# EAGLE schematic zero_board (EAGLE 9.5.2)
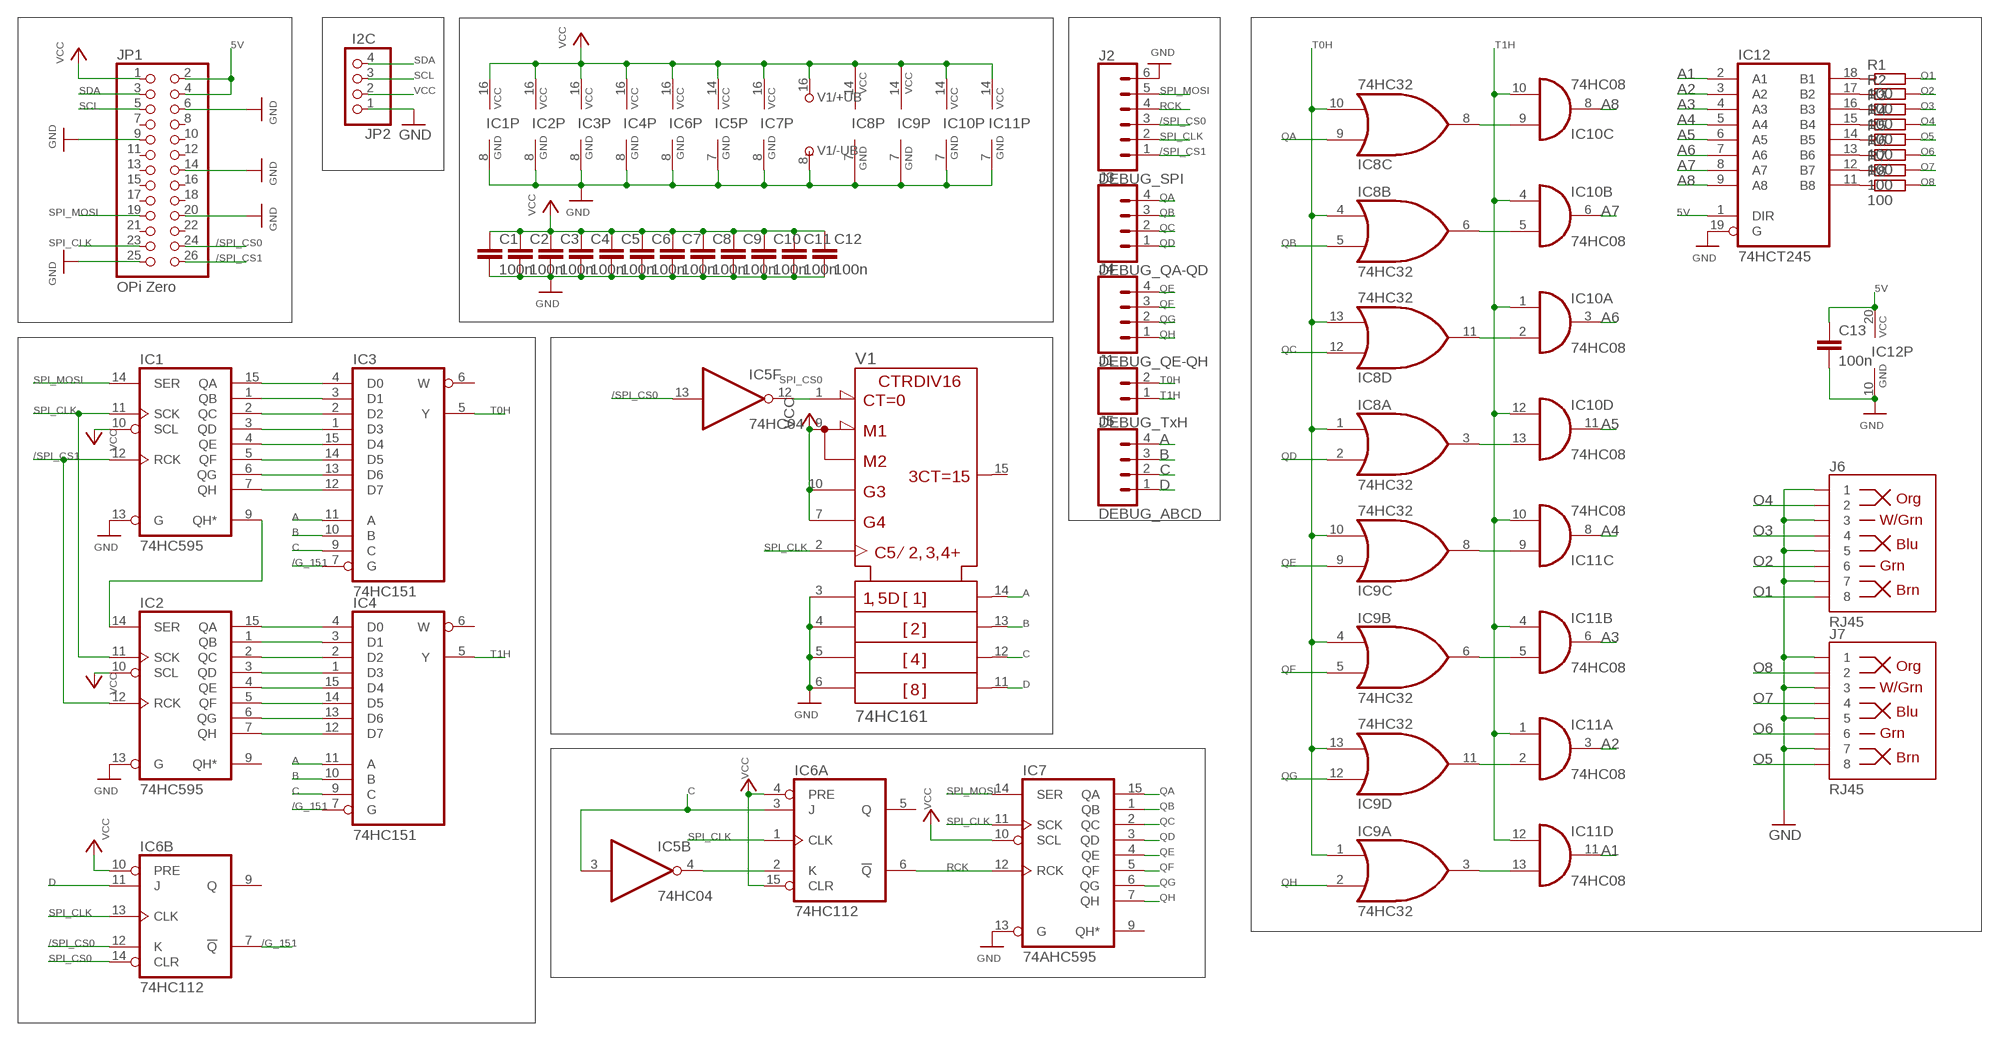
[diagram p0: schematic, sheet 1]

## Parts
C1  100n  C-EU050-024X044  [C050-024X044]
C2  100n  C-EU050-024X044  [C050-024X044]
C3  100n  C-EU050-024X044  [C050-024X044]
C4  100n  C-EU050-024X044  [C050-024X044]
C5  100n  C-EU050-024X044  [C050-024X044]
C6  100n  C-EU050-024X044  [C050-024X044]
C7  100n  C-EU050-024X044  [C050-024X044]
C8  100n  C-EU050-024X044  [C050-024X044]
C9  100n  C-EU050-024X044  [C050-024X044]
C10  100n  C-EU050-024X044  [C050-024X044]
C11  100n  C-EU050-024X044  [C050-024X044]
C12  100n  C-EU050-024X044  [C050-024X044]
C13  100n  C-EU050-024X044  [C050-024X044]
IC1  74HC595  74HC595N  [DIL16]
IC2  74HC595  74HC595N  [DIL16]
IC3  74HC151  74HC151N  [DIL16]
IC4  74HC151  74HC151N  [DIL16]
IC5  74HC04  74HC04N  [DIL14]
IC6  74HC112  74HC112N  [DIL16]
IC7  74AHC595  74HC595D  [SO16]
IC8  74HC32  74LS32N  [DIL14]
IC9  74HC32  74LS32N  [DIL14]
IC10  74HC08  74AS08N  [DIL14]
IC11  74HC08  74AS08N  [DIL14]
IC12  74HCT245  74ACT245N  [DIL20]
J1  DEBUG_TxH  CONN_02  [1X02]
J2  DEBUG_SPI  CONN_06LOCK  [1X06_LOCK]
J3  DEBUG_QA-QD  CONN_04LOCK  [1X04_LOCK]
J4  DEBUG_QE-QH  CONN_04LOCK  [1X04_LOCK]
J5  DEBUG_ABCD  CONN_04LOCK  [1X04_LOCK]
J6  RJ45  RJ45-8  [RJ45-8]
J7  RJ45  RJ45-8  [RJ45-8]
JP1  OPi Zero  PINHD-2X13  [2X13]
JP2  I2C  PINHD-1X4  [1X04]
R1  100  R-EU_0204/5  [0204/5]
R2  100  R-EU_0204/5  [0204/5]
R3  100  R-EU_0204/5  [0204/5]
R4  100  R-EU_0204/5  [0204/5]
R5  100  R-EU_0204/5  [0204/5]
R6  100  R-EU_0204/5  [0204/5]
R7  100  R-EU_0204/5  [0204/5]
R8  100  R-EU_0204/5  [0204/5]
V1  74HC161  74161N  [DIL16]

## Nets
5V: C13.1 IC12.1(DIR) IC12.20(VCC) JP1.2 JP1.4
/G_151: IC3.7(G) IC4.7(G) IC6.7(B:!Q)
/SPI_CS0: IC5.13(F:I) IC6.12(B:K) J2.3 JP1.24
/SPI_CS1: IC1.12(RCK) IC2.12(RCK) J2.1 JP1.26
A: IC3.11(A) IC4.11(A) J5.4 V1.14(QA)
A1: IC11.11(D:O) IC12.2(A1)
A2: IC11.3(A:O) IC12.3(A2)
A3: IC11.6(B:O) IC12.4(A3)
A4: IC11.8(C:O) IC12.5(A4)
A5: IC10.11(D:O) IC12.6(A5)
A6: IC10.3(A:O) IC12.7(A6)
A7: IC10.6(B:O) IC12.8(A7)
A8: IC10.8(C:O) IC12.9(A8)
B: IC3.10(B) IC4.10(B) J5.3 V1.13(QB)
C: IC3.9(C) IC4.9(C) IC5.3(B:I) IC6.3(A:J) J5.2 V1.12(QC)
D: IC6.11(B:J) J5.1 V1.11(QD)
GND: C1.2 C2.2 C3.2 C4.2 C5.2 C6.2 C7.2 C8.2 C9.2 C10.2 C11.2 C12.2 C13.2 IC1.8(GND) IC1.13(G) IC2.8(GND) IC2.13(G) IC3.8(GND) IC4.8(GND) IC5.7(P:GND) IC6.8(P:GND) IC7.8(GND) IC7.13(G) IC8.7(P:GND) IC9.7(P:GND) IC10.7(P:GND) IC11.7(P:GND) IC12.10(GND) IC12.19(G) J2.6 J6.1 J6.3 J6.5 J6.7 J7.1 J7.3 J7.5 J7.7 JP1.6 JP1.9 JP1.14 JP1.20 JP1.25 JP2.1 V1.3(A) V1.4(B) V1.5(C) V1.6(D) V1.8(-UB)
N$1: IC9.8(C:O) IC11.9(C:I0)
N$2: IC9.6(B:O) IC11.5(B:I1)
N$3: IC9.11(D:O) IC11.2(A:I1)
N$4: IC9.3(A:O) IC11.13(D:I1)
N$5: IC8.8(C:O) IC10.9(C:I0)
N$6: IC8.6(B:O) IC10.5(B:I1)
N$7: IC8.11(D:O) IC10.2(A:I1)
N$11: IC1.15(QA) IC3.4(D0)
N$12: IC1.1(QB) IC3.3(D1)
N$13: IC1.2(QC) IC3.2(D2)
N$14: IC1.3(QD) IC3.1(D3)
N$15: IC5.4(B:O) IC6.2(A:K)
N$16: IC8.3(A:O) IC10.13(D:I1)
N$19: IC2.15(QA) IC4.4(D0)
N$21: IC1.4(QE) IC3.15(D4)
N$22: IC1.5(QF) IC3.14(D5)
N$23: IC1.6(QG) IC3.13(D6)
N$24: IC1.7(QH) IC3.12(D7)
N$25: IC2.1(QB) IC4.3(D1)
N$27: IC2.2(QC) IC4.2(D2)
N$28: IC2.3(QD) IC4.1(D3)
N$29: IC2.4(QE) IC4.15(D4)
N$30: IC2.5(QF) IC4.14(D5)
N$31: IC2.6(QG) IC4.13(D6)
N$32: IC2.7(QH) IC4.12(D7)
N$35: IC12.18(B1) R1.1
N$37: IC12.17(B2) R2.1
N$38: IC12.16(B3) R3.1
N$39: IC12.15(B4) R4.1
N$40: IC12.14(B5) R5.1
N$41: IC12.13(B6) R6.1
N$42: IC12.12(B7) R7.1
N$43: IC12.11(B8) R8.1
N$44: IC1.9(QH*) IC2.14(SER)
O1: J6.8 R1.2
O2: J6.6 R2.2
O3: J6.4 R3.2
O4: J6.2 R4.2
O5: J7.8 R5.2
O6: J7.6 R6.2
O7: J7.4 R7.2
O8: J7.2 R8.2
QA: IC7.15(QA) IC8.9(C:I0) J3.4
QB: IC7.1(QB) IC8.5(B:I1) J3.3
QC: IC7.2(QC) IC8.12(D:I0) J3.2
QD: IC7.3(QD) IC8.2(A:I1) J3.1
QE: IC7.4(QE) IC9.9(C:I0) J4.4
QF: IC7.5(QF) IC9.5(B:I1) J4.3
QG: IC7.6(QG) IC9.12(D:I0) J4.2
QH: IC7.7(QH) IC9.2(A:I1) J4.1
RCK: IC6.6(A:!Q) IC7.12(RCK) J2.4
SCL: JP1.5 JP2.3
SDA: JP1.3 JP2.4
SPI_CLK: IC1.11(SCK) IC2.11(SCK) IC6.1(A:CLK) IC6.13(B:CLK) IC7.11(SCK) J2.2 JP1.23 V1.2(CLK)
SPI_CS0: IC5.12(F:O) IC6.14(B:CLR) V1.1(!CLR)
SPI_MOSI: IC1.14(SER) IC7.14(SER) J2.5 JP1.19
T0H: IC3.5(Y) IC8.1(A:I0) IC8.4(B:I0) IC8.10(C:I1) IC8.13(D:I1) IC9.1(A:I0) IC9.4(B:I0) IC9.10(C:I1) IC9.13(D:I1) J1.2
T1H: IC4.5(Y) IC10.1(A:I0) IC10.4(B:I0) IC10.10(C:I1) IC10.12(D:I0) IC11.1(A:I0) IC11.4(B:I0) IC11.10(C:I1) IC11.12(D:I0) J1.1
VCC: C1.1 C2.1 C3.1 C4.1 C5.1 C6.1 C7.1 C8.1 C9.1 C10.1 C11.1 C12.1 IC1.10(SCL) IC1.16(VCC) IC2.10(SCL) IC2.16(VCC) IC3.16(VCC) IC4.16(VCC) IC5.14(P:VCC) IC6.4(A:PRE) IC6.10(B:PRE) IC6.15(A:CLR) IC6.16(P:VCC) IC7.10(SCL) IC7.16(VCC) IC8.14(P:VCC) IC9.14(P:VCC) IC10.14(P:VCC) IC11.14(P:VCC) JP1.1 JP2.2 V1.7(ENP) V1.9(!LOAD) V1.10(ENT) V1.16(+UB)
Unconnected: IC2.9(QH*) IC3.6(W) IC4.6(W) IC5.1(A:I) IC5.2(A:O) IC5.5(C:I) IC5.6(C:O) IC5.8(D:O) IC5.9(D:I) IC5.10(E:O) IC5.11(E:I) IC6.5(A:Q) IC6.9(B:Q) IC7.9(QH*) JP1.7 JP1.8 JP1.10 JP1.11 JP1.12 JP1.13 JP1.15 JP1.16 JP1.17 JP1.18 JP1.21 JP1.22 V1.15(RCO)

## Library data of the parts
C1-C13 = rcl:C-EU: CAPACITOR, European symbol; SPICEPREFIX: C
IC1 IC2 IC7 = 74xx-eu:74*595: 8-bit SHIFT REGISTER, output latch
IC3 IC4 = 74xx-eu:74*151: Data SELECTOR/MULTIPLEXER
IC5 = 74xx-eu:74*04: Hex INVERTER
IC6 = 74xx-eu:74*112: Dual J-K negative edge triggered FLIP FLOP, preset and clear
IC8 IC9 = 74xx-us:74*32: Quad 2-input OR gate
IC10 IC11 = 74xx-eu:74*08: Quad 2-input AND gate
IC12 = 74xx-eu:74*245: Octal BUS TRANSCEIVER, 3-state
J1 = SparkFun-Connectors:CONN_02: Multi connection point. Often used as Generic Header-pin footprint for 0.1 inch spaced/style header connections On any of the 0.1 inch spaced packages, you can populate with these: Break Away Headers - Straight <https://www.sparkfun.com/products/116> (PRT-00116) Break Away Male Headers - Right Angle <https://www.sparkfun.com/products/553> (PRT-00553) Female Headers <https://www.sparkfun.com/products/115> (PRT-00115) Break Away Headers - Machine Pin <https://www.sparkfun.com/products/117> (PRT-00117) Break Away Female Headers - Swiss Machine Pin <https://www.sparkfun.com/products/743> (PRT-00743) For SCREWTERMINALS and SPRING TERMINALS visit here: Screw Terimnals on SparkFun.com <https://www.sparkfun.com/search/results?term=Screw+Terminals> (5mm/3.5mm/2.54mm spacing) This device is also useful as a general connection point to wire up your design to another part of your project. Our various solder wires solder well into these plated through hole pads. Hook-Up Wire - Assortment (Stranded, 22 AWG) <https://www.sparkfun.com/products/11375> (PRT-11375) Hook-Up Wire - Assortment (Solid Core, 22 AWG) <https://www.sparkfun.com/products/11367> (PRT-11367) View the entire wire category on our website here <https://www.sparkfun.com/categories/141> Special notes: Molex polarized connector foot print use with: PRT-08233 with associated crimp pins and housings. 2.54_SCREWTERM for use with PRT-10571. 3.5mm Screw Terminal footprints for PRT-08084 5mm Screw Terminal footprints for use with PRT-08432
J2 = SparkFun-Connectors:CONN_06: Multi connection point. Often used as Generic Header-pin footprint for 0.1 inch spaced/style header connections On any of the 0.1 inch spaced packages, you can populate with these: Break Away Headers - Straight <https://www.sparkfun.com/products/116> (PRT-00116) Break Away Male Headers - Right Angle <https://www.sparkfun.com/products/553> (PRT-00553) Female Headers <https://www.sparkfun.com/products/115> (PRT-00115) Break Away Headers - Machine Pin <https://www.sparkfun.com/products/117> (PRT-00117) Break Away Female Headers - Swiss Machine Pin <https://www.sparkfun.com/products/743> (PRT-00743) Arduino Stackable Header - 6 Pin <https://www.sparkfun.com/products/9280> (PRT-09280) For SCREWTERMINALS and SPRING TERMINALS visit here: Screw Terimnals on SparkFun.com <https://www.sparkfun.com/search/results?term=Screw+Terminals> (5mm/3.5mm/2.54mm spacing) This device is also useful as a general connection point to wire up your design to another part of your project. Our various solder wires solder well into these plated through hole pads. Hook-Up Wire - Assortment (Stranded, 22 AWG) <https://www.sparkfun.com/products/11375> (PRT-11375) Hook-Up Wire - Assortment (Solid Core, 22 AWG) <https://www.sparkfun.com/products/11367> (PRT-11367) View the entire wire category on our website here <https://www.sparkfun.com/categories/141>
J3-J5 = SparkFun-Connectors:CONN_04: Multi connection point. Often used as Generic Header-pin footprint for 0.1 inch spaced/style header connections On any of the 0.1 inch spaced packages, you can populate with these: Break Away Headers - Straight <https://www.sparkfun.com/products/116> (PRT-00116) Break Away Male Headers - Right Angle <https://www.sparkfun.com/products/553> (PRT-00553) Female Headers <https://www.sparkfun.com/products/115> (PRT-00115) Break Away Headers - Machine Pin <https://www.sparkfun.com/products/117> (PRT-00117) Break Away Female Headers - Swiss Machine Pin <https://www.sparkfun.com/products/743> (PRT-00743) For SCREWTERMINALS and SPRING TERMINALS visit here: Screw Terimnals on SparkFun.com <https://www.sparkfun.com/search/results?term=Screw+Terminals> (5mm/3.5mm/2.54mm spacing) This device is also useful as a general connection point to wire up your design to another part of your project. Our various solder wires solder well into these plated through hole pads. Hook-Up Wire - Assortment (Stranded, 22 AWG) <https://www.sparkfun.com/products/11375> (PRT-11375) Hook-Up Wire - Assortment (Solid Core, 22 AWG) <https://www.sparkfun.com/products/11367> (PRT-11367) View the entire wire category on our website here <https://www.sparkfun.com/categories/141> Special notes: Molex polarized connector foot print use with SKU : PRT-08231 with associated crimp pins and housings. 1MM SMD Version SKU: PRT-10208; PROD_ID: CONN-09696
J6 J7 = SparkFun-Connectors:RJ45-8: RJ45 Jack - 8 pin Simple RJ45, 8-pin connection. Commonly used for Cat5, Cat5e, and Cat6 Ethernet cables. Here is the connector we sell at SparkFun: RJ45 8-Pin Connector <https://www.sparkfun.com/products/643> (PRT-00643) Datasheet <https://cdn.sparkfun.com/datasheets/Prototyping/04908.pdf> It is used on this SparkFun product: SparkFun RJ45 Breakout <https://www.sparkfun.com/products/716> (BOB-00716) Note, you may also be interested in the "MAGJACK" version of this. It is basically a RJ45 connector, but also has some status LEDs built into the connector housing. You can check that out in this library at the device named "MAGJACK.dev" and see these products online: RJ45 Ethernet MagJack-Compatible <https://www.sparkfun.com/products/8534> (PRT-08534) SparkFun RJ45 MagJack Breakout <https://www.sparkfun.com/products/13021> (BOB-13021); PROD_ID: CONN-08506; SF_ID: PRT-00643
JP1 = pinhead:PINHD-2X13: PIN HEADER
JP2 = pinhead:PINHD-1X4: PIN HEADER
R1-R8 = rcl:R-EU_: RESISTOR, European symbol
V1 = 74ttl-din:74*161: Synchrounus 4-bit COUNTER

## Net classes
0 default: clearance 0.205 mm